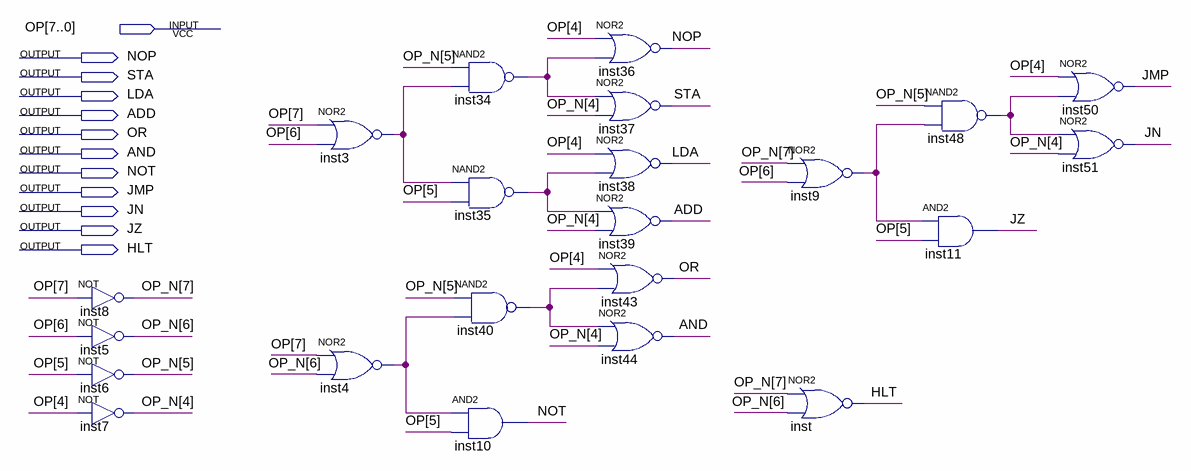
[diagram p0: schematic sheet]
// Quartus schematic OP_DECODER.bdf as structural Verilog: 22 symbols, 12 pins
module OP_DECODER (
  input  [7:0] OP,
  output NOP,
  output STA,
  output LDA,
  output ADD,
  output OR,
  output AND,
  output NOT,
  output JMP,
  output JN,
  output JZ,
  output HLT
);

  wire inst3_out, inst4_out, inst9_out, inst34_out, inst35_out, inst40_out, inst48_out;
  wire [7:4] OP_N;

  not inst8 (OP_N[7], OP[7]);
  not inst5 (OP_N[6], OP[6]);
  not inst6 (OP_N[5], OP[5]);
  not inst7 (OP_N[4], OP[4]);
  nor inst3 (inst3_out, OP[7], OP[6]);
  nor inst4 (inst4_out, OP[7], OP_N[6]);
  nand inst34 (inst34_out, OP_N[5], inst3_out);
  nand inst35 (inst35_out, inst3_out, OP[5]);
  nand inst40 (inst40_out, OP_N[5], inst4_out);
  and inst10 (NOT, inst4_out, OP[5]);
  nor inst36 (NOP, OP[4], inst34_out);
  nor inst37 (STA, inst34_out, OP_N[4]);
  nor inst38 (LDA, OP[4], inst35_out);
  nor inst39 (ADD, inst35_out, OP_N[4]);
  nor inst43 (OR, OP[4], inst40_out);
  nor inst44 (AND, inst40_out, OP_N[4]);
  nor inst9 (inst9_out, OP_N[7], OP[6]);
  nor inst (HLT, OP_N[7], OP_N[6]);
  nand inst48 (inst48_out, OP_N[5], inst9_out);
  and inst11 (JZ, inst9_out, OP[5]);
  nor inst50 (JMP, OP[4], inst48_out);
  nor inst51 (JN, inst48_out, OP_N[4]);
endmodule
